# Altium project DMotor.PrjPcb
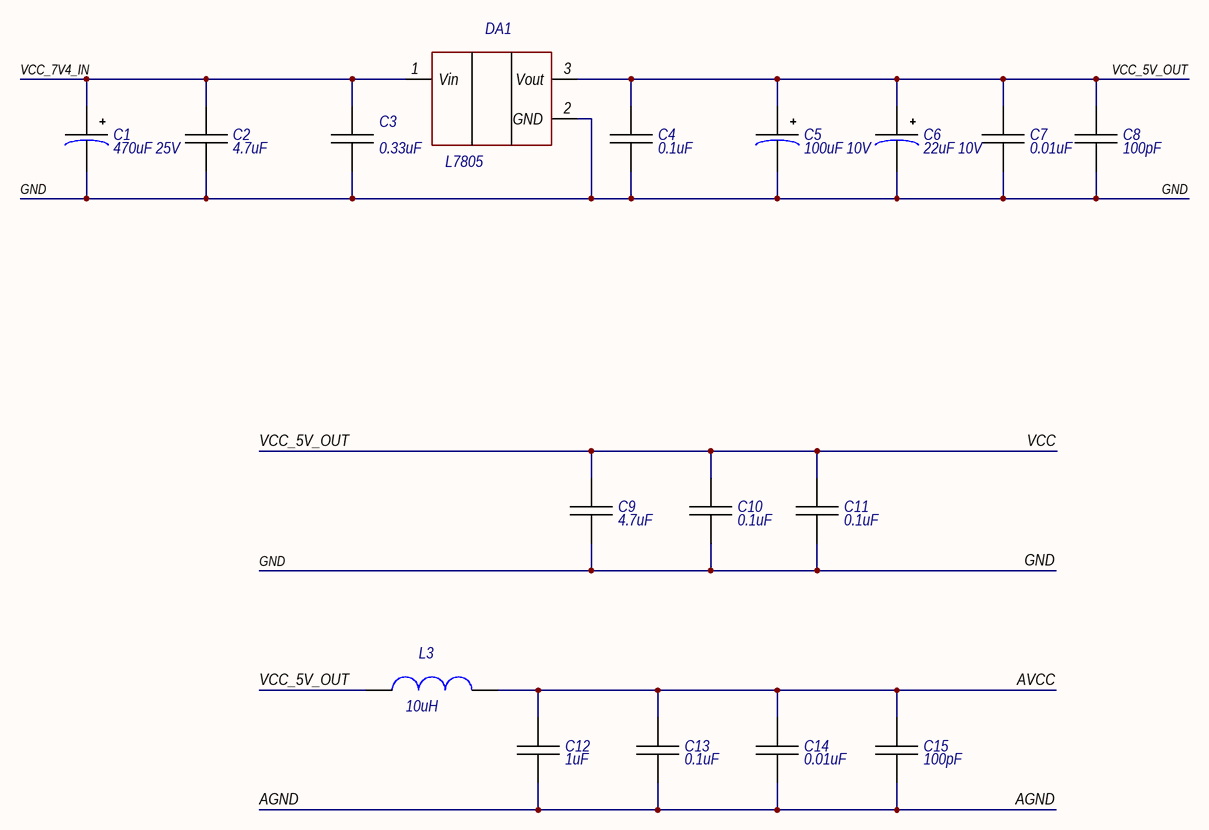
[diagram p0: DMotor_Schematic_page1.SchDoc]
2 sheets, 30 parts. Net scope: global (net labels, ports and power ports of the same name join across sheets).
Board file: DMotor_PCB v2.8.PcbDoc
Sheets:
  DMotor_Schematic_page1.SchDoc
  DMotor_Schematic_page2.SchDoc

## Sheet DMotor_Schematic_page1.SchDoc
size 420 x 297 mm; Author: Дубатовка В.В.; Address1: Address1; Address2: Address2; Address3: Address3; Address4: Address4; DocumentNumber: АБВГ.123456.001 Э3; SheetNumber: 1; SheetTotal: 3; Scale: 1:1; DocumentType: Схема электрическая принципиальная; FirstReferrence: АБВГ.123456.001

### Parts
C1  470uF 25V  [CapElec_8x16_3.5mm]
C2  4.7uF  [C0603]
C3  0.33uF  [C0603]
C4  0.1uF  [C0603]
C5  100uF 10V  [CapElec_5x11_2mm]
C6  22uF 10V  [TANT-B]
C7  0.01uF  [C0603]
C8  100pF  [C0603]
C9  4.7uF  [C0603]
C10  0.1uF  [C0603]
C11  0.1uF  [C0603]
C12  1uF  [C0603]
C13  0.1uF  [C0603]
C14  0.01uF  [C0603]
C15  100pF  [C0603]
DA1  L7805  [TO-220A]
L3  10uH  [IND1206]

### Nets
AGND: C12.2 C13.2 C14.2 C15.2
AVCC: C12.1 C13.1 C14.1 C15.1 L3.2
GND: C1.2 C2.2 C3.2 C4.2 C5.2 C6.2 C7.2 C8.2 C9.2 C10.2 C11.2 DA1.2(GND)
VCC: C4.1 C5.1 C6.1 C7.1 C8.1 C9.1 C10.1 C11.1 DA1.3(Vout) L3.1  [also labelled VCC_5V_OUT]
VCC_7V4_IN: C1.1 C2.1 C3.1 DA1.1(Vin)

### Notes on the sheet
- Перв. примен.
- Справ. №
- Подп. и дата
- Инв. № дубл.
- Взам. инв. №
- Разраб.
- Изм.
- Лист
- № докум.
- Подп.
- Дата
- Лит.
- Масса
- Масштаб
- Пров.
- Т.контр.
- Листов
- Инв. № подл.
- Утв.
- Н.контр.
- 2.106-A3
- Копировал
- Формат А3

### Library data of the parts
C1 = Capacitor_Elec: Manufacturer: JB; Model: 25V 20%; Value: 470uF 25V; HelpURL: https://www.chipdip.by/product0/9000565915; Case: 8x16_3.5mm
C2 C9 = Capasitor: Manufacturer: Murata; Model: GRM188R61A475K; Value: 4.7uF; Case: C0603; HelpURL: https://www.chipdip.by/product0/9000193550
C3 = Capasitor: Manufacturer: RUF; Value: 0.33uF; Case: C0603; HelpURL: https://belchip.by/product/?selected_product=01610; Model: *
C4 = Capasitor: X7R 50В 10% 0603; Manufacturer: Murata; Model: GRM188R71H104K; Value: 0.1uF; Case: C0603; HelpURL: https://www.chipdip.by/product/grm188r71h104k
C5 = Capacitor_Elec: Manufacturer: JB; Model: 10V 20%; Value: 100uF 10V; HelpURL: https://www.chipdip.by/product0/9000565886; Case: 5x11_2mm
C6 = Capasitor_Tantalum: Model: 10V 10%; Value: 22uF 10V; Case: TANT-B; Manufacturer: -; HelpURL: https://www.chipdip.by/product0/9000502415
C7 = Capasitor: Manufacturer: Murata; Model: X7R 50В 10% 0603; Value: 0.01uF; Case: C0603; HelpURL: https://www.chipdip.by/product/grm188r71h103k
C8 = Capasitor: Manufacturer: Murata; Model: NPO 50В 5% 0603; Value: 100pF; Case: C0603; HelpURL: https://www.chipdip.by/product/grm1885c1h101j
C10 C11 C13 = Capasitor: Manufacturer: Murata; Model: GRM188R71H104K; Value: 0.1uF; Case: C0603; HelpURL: https://www.chipdip.by/product/grm188r71h104k
C12 = Capasitor: X7R 1мкФ 16В 10% 0603; Manufacturer: Murata; Model: GRM188R71C105KA12D; Value: 1uF; Case: C0603; HelpURL: https://www.chipdip.by/product/grm188r71c105ka12d
C14 C15 = Capasitor: Case: C0603; Manufacturer: *; HelpURL: *; Model: *
  C14: Value: 0.01uF
  C15: Value: 100pF
DA1 = L75xx: Linear Voltage Regulator IC  1 Output  1.5A TO-220AB; Manufacturer: STMicroelectronics; Case: TO-220; HelpURL: https://www.chipdip.by/product/l7805acv-dg; Model: L7805
L3 = Inductivity: Manufacturer: Murata; Model: LQH31CN100K03L; HelpURL: https://www.chipdip.by/product/lqh31cn100k03l; Case: IND1206; Value: 10uH

## Sheet DMotor_Schematic_page2.SchDoc
size 420 x 297 mm; Address1: Address1; Address2: Address2; Address3: Address3; Address4: Address4; DocumentNumber: АБВГ.123456.001 Э3; SheetNumber: 1; Scale: 1:1; DocumentType: Схема электрическая принципиальная; FirstReferrence: АБВГ.123456.001
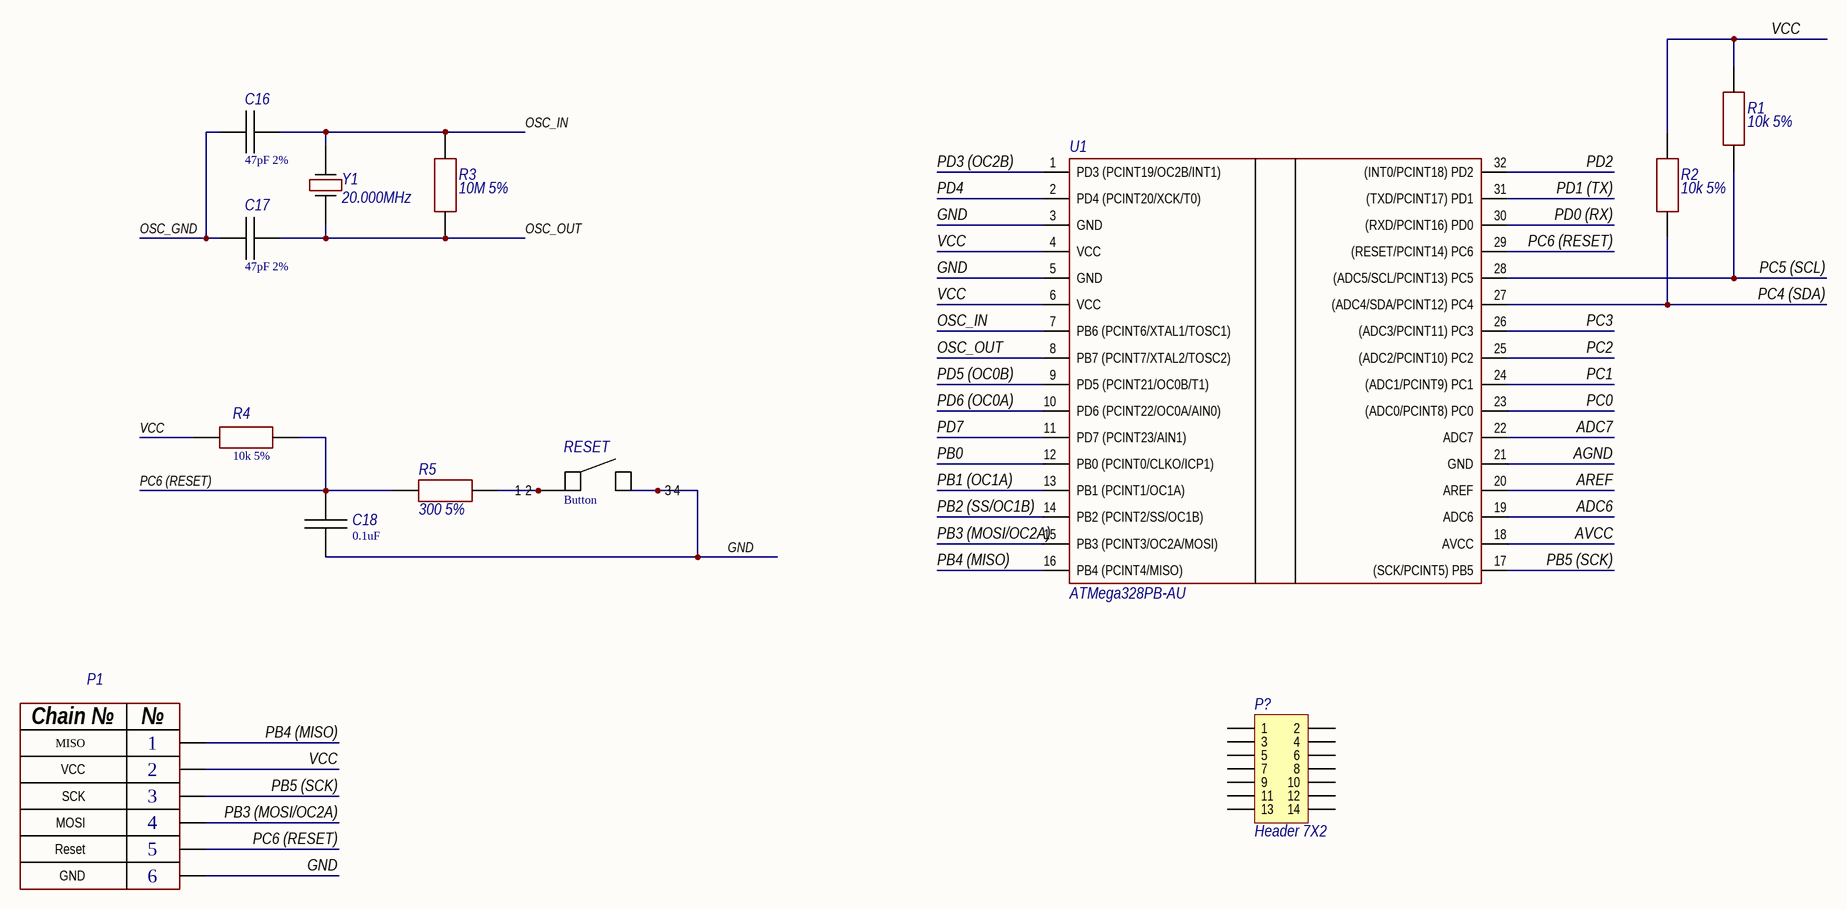
[diagram p1: DMotor_Schematic_page2.SchDoc]

### Parts
C16  47pF 2%  [C0603]
C17  47pF 2%  [C0603]
C18  0.1uF  [C0603]
P1  ICSP  [2x3 Male Header Through Hole Pitch 2.54 mm]  (value not drawn)
P?  Header 7X2  [HDR2X7]
R1  10k 5%  [R0603]
R2  10k 5%  [R0603]
R3  10M 5%  [R0603]
R4  10k 5%  [R0603]
R5  300 5%  [R0603]
RESET  Button  [KMR221GLFS]
U1  ATMega328PB-AU  [TQFP-32 (7x7)]
Y1  20.000MHz  [HC-49S]

### Nets
ADC6: U1.19(ADC6)
ADC7: U1.22(ADC7)
AGND: U1.21(GND)
AREF: U1.20(AREF)
AVCC: U1.18(AVCC)
GND: C18.2 P1.6(GND) RESET.3 RESET.4 U1.3(GND) U1.5(GND)
OSC_GND: C16.1 C17.2
OSC_IN: C16.2 R3.2 U1.7(PB6_(PCINT6/XTAL1/TOSC1)) Y1.2
OSC_OUT: C17.1 R3.1 U1.8(PB7_(PCINT7/XTAL2/TOSC2)) Y1.1
PB0: U1.12(PB0_(PCINT0/CLKO/ICP1))
PB1 (OC1A): U1.13(PB1_(PCINT1/OC1A))
PB2 (SS/OC1B): U1.14(PB2_(PCINT2/SS/OC1B))
PB3 (MOSI/OC2A): P1.4(MOSI) U1.15(PB3_(PCINT3/OC2A/MOSI))
PB4 (MISO): P1.1(MISO) U1.16(PB4_(PCINT4/MISO))
PB5 (SCK): P1.3(SCK) U1.17((SCK/PCINT5)_PB5)
PC0: U1.23((ADC0/PCINT8)_PC0)
PC1: U1.24((ADC1/PCINT9)_PC1)
PC2: U1.25((ADC2/PCINT10)_PC2)
PC3: U1.26((ADC3/PCINT11)_PC3)
PC4 (SDA): R2.1 U1.27((ADC4/SDA/PCINT12)_PC4)
PC5 (SCL): R1.1 U1.28((ADC5/SCL/PCINT13)_PC5)
PC6 (RESET): C18.1 P1.5(Reset) R4.2 R5.1 U1.29((RESET/PCINT14)_PC6)
PD0 (RX): U1.30((RXD/PCINT16)_PD0)
PD1 (TX): U1.31((TXD/PCINT17)_PD1)
PD2: U1.32((INT0/PCINT18)_PD2)
PD3 (OC2B): U1.1(PD3_(PCINT19/OC2B/INT1))
PD4: U1.2(PD4_(PCINT20/XCK/T0))
PD5 (OC0B): U1.9(PD5_(PCINT21/OC0B/T1))
PD6 (OC0A): U1.10(PD6_(PCINT22/OC0A/AIN0))
PD7: U1.11(PD7_(PCINT23/AIN1))
VCC: P1.2(VCC) R1.2 R2.2 R4.1 U1.4(VCC) U1.6(VCC)
NetR5_2: R5.2 RESET.1 RESET.2

Not connected (* = marked no-connect by the designer): P? 1 2 3 4 5 6 7 8 9 10 11 12 13 14

### Notes on the sheet
- Перв. примен.
- Справ. №
- Подп. и дата
- Инв. № дубл.
- Взам. инв. №
- Разраб.
- Изм.
- Лист
- № докум.
- Подп.
- Дата
- Лит.
- Масса
- Масштаб
- Пров.
- Т.контр.
- Листов
- Инв. № подл.
- Утв.
- Н.контр.
- 2.106-A3
- Копировал
- Формат А3
- (in symbol ICSP) Chain №; №

### Library data of the parts
C16 C17 = Capasitor: C0G 47пФ 100В 2% 0603; Manufacturer: Murata; Model: GRM1885C2A470GA01D; Value: 47pF 2%; Case: C0603; HelpURL: https://www.chipdip.by/product/grm1885c2a470ga01d
C18 = Capasitor: as C10 on sheet DMotor_Schematic_page1; Value: 0.1uF; Case: C0603; HelpURL: https://www.chipdip.by/product/grm188r71h104k
P? = Header 7X2: Header, 7-Pin, Dual row; LatestRevisionDate: 17-Jul-2002; LatestRevisionNote: Re-released for DXP Platform.; Publisher: Altium Limited
R1-R5 = Resistor: Model: *; Manufacturer: *
  R1 R2 R4: Value: 10k 5%; HelpURL: *; Case: *
  R3: Value: 10M 5%; HelpURL: https://www.chipdip.by/product0/65097; Case: R0603
  R5: Value: 300 5%; HelpURL: https://www.chipdip.by/product0/16872; Case: R0603
RESET = Button: SWITCH TACTILE SPST-NO 0.05A 32V; Manufacturer: KLS electronic co ltd; Model: KLS7-TS3401- 2,5-180(TVAF11); HelpURL: https://www.chipdip.by/product/kls7-ts3401-2-5-180-tvaf11; Case: KMR221GLFS
U1 = ATMega328P: AVR AVR® ATmega Microcontroller IC 8-Bit 20MHz 32KB (16K x 16) FLASH 32-TQFP (7x7); Manufacturer: Microchip Technology; Model: ATMega328PB-AU; HelpURL: https://www.digikey.com/product-detail/en/microchip-technology/ATMEGA328PB-AU/ATMEGA328PB-AU-ND/5638812; Case: TQFP-32
Y1 = Crystal: Value: 20.000MHz; Model: *; HelpURL: https://www.chipdip.by/product/20mhz-hc-49s; Case: HC-49S; Manufacturer: *
P1 = ICSP: Case: *; Model: *; HelpURL: *

## Nets that join several sheets
AGND: DMotor_Schematic_page1 (C12.2 C13.2 C14.2 C15.2), DMotor_Schematic_page2 (U1.21)
AVCC: DMotor_Schematic_page1 (5 pins), DMotor_Schematic_page2 (U1.18)
GND: DMotor_Schematic_page1 (12 pins), DMotor_Schematic_page2 (6 pins)
VCC: DMotor_Schematic_page1 (10 pins), DMotor_Schematic_page2 (6 pins)